# Altium schematic sheet OV7725.SchDoc
size A4
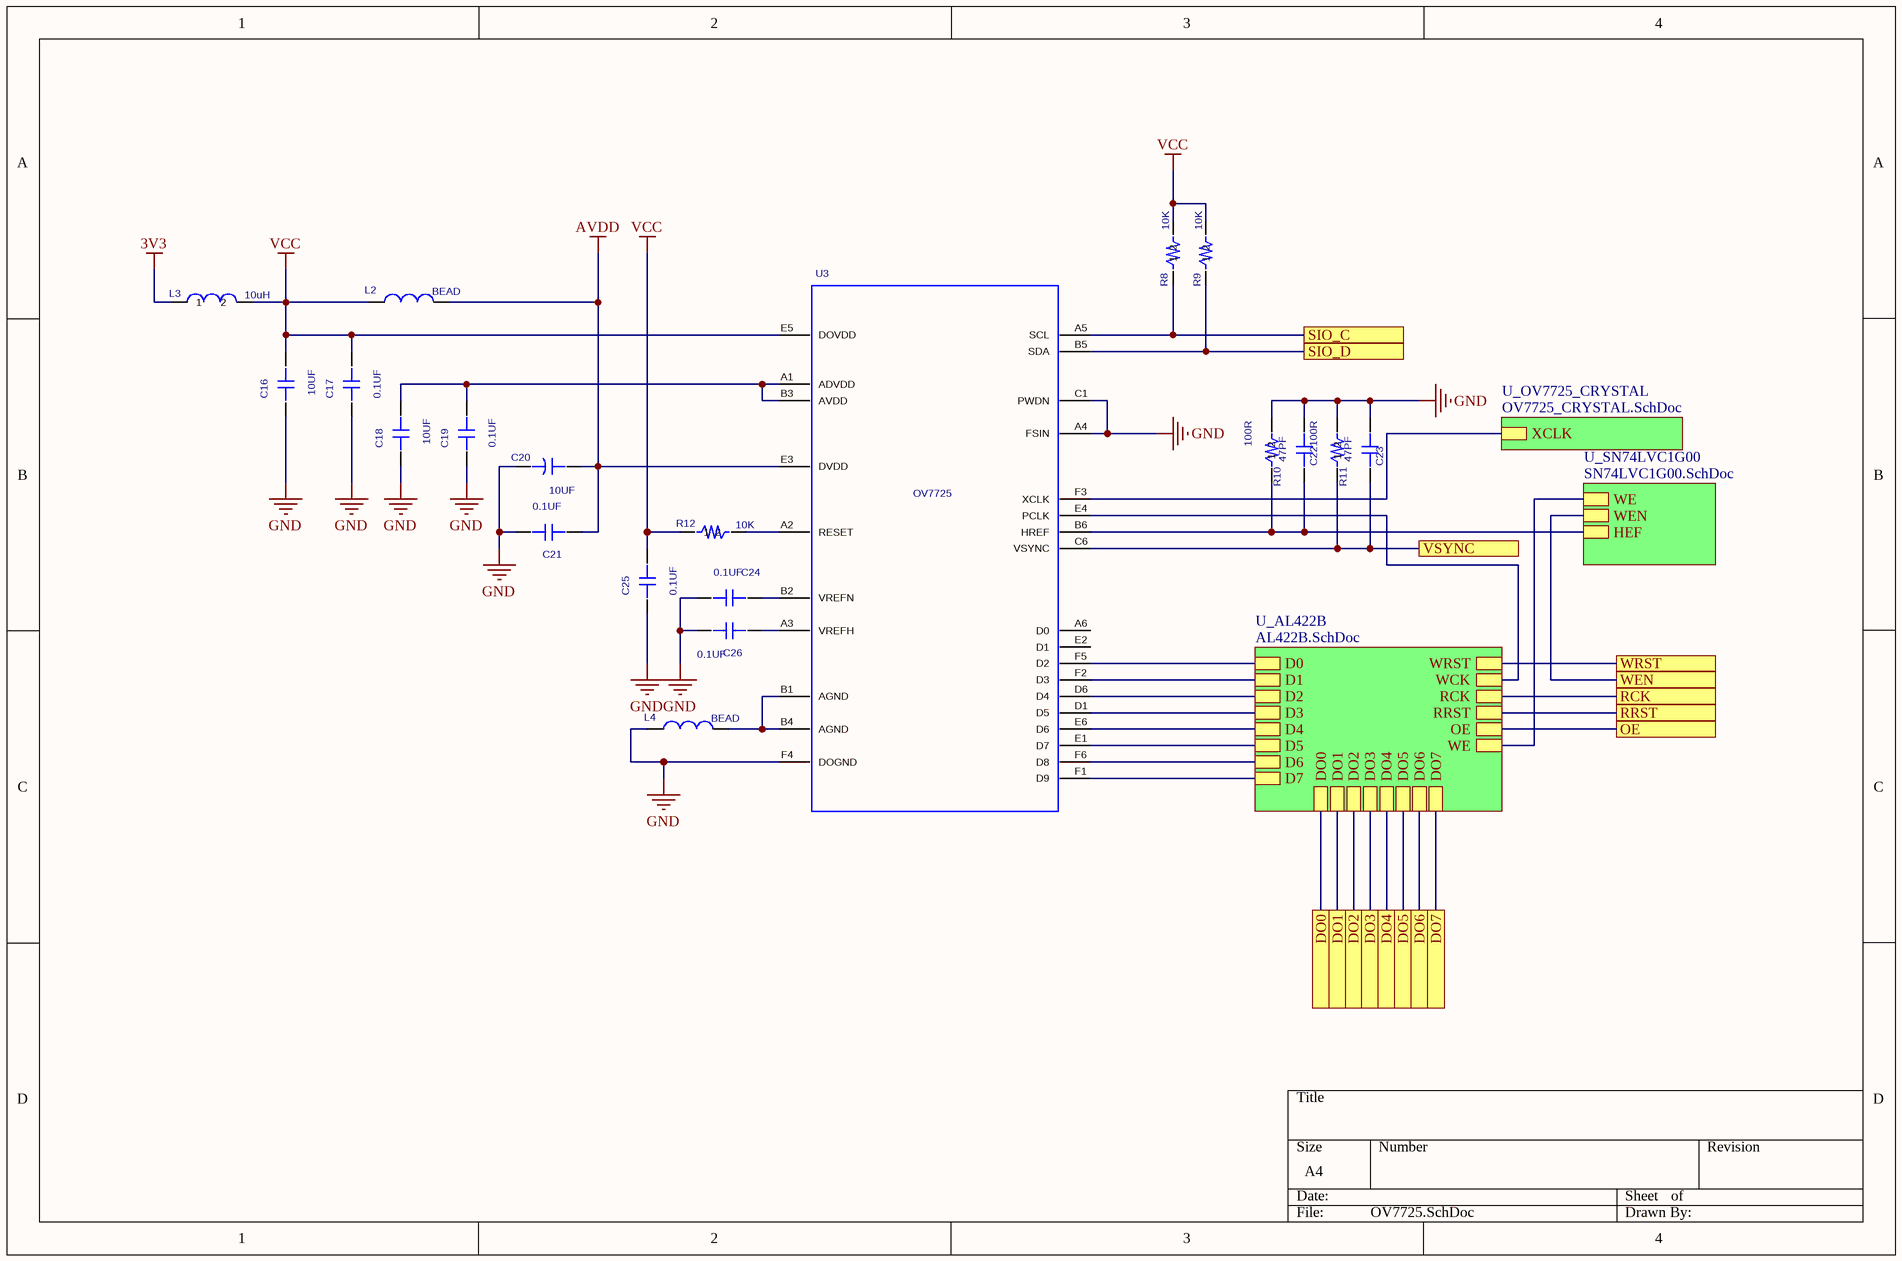
[diagram p0: OV7725.SchDoc]

## Parts
C16  value 10UF  [CAP_0603_FIRE]  (hidden comment: CAP_10UF_0603_FIRE)
C17  value 0.1UF  [SC0402]  (hidden comment: CAP_0.1UF_0402_FIRE)
C18  value 10UF  [CAP_0603_FIRE]  (hidden comment: CAP_10UF_0603_FIRE)
C19  value 0.1UF  [SC0402]  (hidden comment: CAP_0.1UF_0402_FIRE)
C20  value 10UF  [C1206]  (hidden comment: CAP+_10UF_C1206_FIRE)
C21  value 0.1UF  [SC0402]  (hidden comment: CAP_0.1UF_0402_FIRE)
C22  value 47PF  [SC0402]  (hidden comment: CAP_47PF_0402_FIRE)
C23  value 47PF  [SC0402]  (hidden comment: CAP_47PF_0402_FIRE)
C24  value 0.1UF  [SC0402]  (hidden comment: CAP_0.1UF_0402_FIRE)
C25  value 0.1UF  [SC0402]  (hidden comment: CAP_0.1UF_0402_FIRE)
C26  value 0.1UF  [SC0402]  (hidden comment: CAP_0.1UF_0402_FIRE)
L2  value BEAD  [L0603]  (hidden comment: BEAD-220/100MHZ-0603)
L3  value 10uH  [L0805]  (hidden comment: IND_10UH_0805_FIRE)
L4  value BEAD  [L0603]  (hidden comment: BEAD-220/100MHZ-0603)
R8  value 10K  [SR0402]  (hidden comment: RES_10K_0402_FIRE)
R9  value 10K  [SR0402]  (hidden comment: RES_10K_0402_FIRE)
R10  value 100R  [SR0402]  (hidden comment: RES_100R_0402_FIRE)
R11  value 100R  [SR0402]  (hidden comment: RES_100R_0402_FIRE)
R12  value 10K  [SR0402]  (hidden comment: RES_10K_0402_FIRE)
U3  value OV7725  [OV7725_CSP2_FIRE]  (hidden comment: OV7725_FIRE)

## Sub-sheets
U_AL422B = AL422B.SchDoc: D0, D1, D2, D3, D4, D5, D6, D7, WE, WRST, WCK, RCK, RRST, OE, DO0, DO7, DO1, DO2, DO3, DO4, DO5, DO6
U_OV7725_CRYSTAL = OV7725_CRYSTAL.SchDoc: XCLK
U_SN74LVC1G00 = SN74LVC1G00.SchDoc: WE, HEF, WEN

## Ports
DO0, DO1, DO2, DO3, DO4, DO5, DO6, DO7, OE, RCK, RRST, SIO_C, SIO_D, VSYNC, WEN, WRST

## Nets
3V3: L3.1
AVDD: C20.1(+) C21.1 L2.2 U3.E3(DVDD)
GND: C16.1 C17.1 C18.1 C19.1 C20.2(-) C21.2 C22.2 C23.2 C24.2 C25.1 C26.2 L4.1 R10.2 R11.2 U3.A4(FSIN) U3.C1(PWDN) U3.F4(DOGND)
VCC: C16.2 C17.2 C25.2 L2.1 L3.2 R8.2 R9.2 R12.1 U3.E5(DOVDD)
DO0: port DO0, sheet U_AL422B/DO0
DO1: port DO1, sheet U_AL422B/DO1
DO2: port DO2, sheet U_AL422B/DO2
DO3: port DO3, sheet U_AL422B/DO3
DO4: port DO4, sheet U_AL422B/DO4
DO5: port DO5, sheet U_AL422B/DO5
DO6: port DO6, sheet U_AL422B/DO6
DO7: port DO7, sheet U_AL422B/DO7
OE: port OE, sheet U_AL422B/OE
RCK: port RCK, sheet U_AL422B/RCK
RRST: port RRST, sheet U_AL422B/RRST
SIO_C: R8.1 U3.A5(SCL) ; port SIO_C
SIO_D: R9.1 U3.B5(SDA) ; port SIO_D
VSYNC: C23.1 R11.1 U3.C6(VSYNC) ; port VSYNC
WEN: port WEN, sheet U_SN74LVC1G00/WEN
WRST: port WRST, sheet U_AL422B/WRST
NetC18_2: C18.2 C19.2 U3.A1(ADVDD) U3.B3(AVDD)
NetC22_1: C22.1 R10.1 U3.B6(HREF) ; sheet U_SN74LVC1G00/HEF
NetC24_1: C24.1 U3.B2(VREFN)
NetC26_1: C26.1 U3.A3(VREFH)
NetL4_2: L4.2 U3.B1(AGND) U3.B4(AGND)
NetR12_2: R12.2 U3.A2(RESET)
NetU3_D1: U3.D1(D5) ; sheet U_AL422B/D3
NetU3_D6: U3.D6(D4) ; sheet U_AL422B/D2
NetU3_E1: U3.E1(D7) ; sheet U_AL422B/D5
NetU3_E4: U3.E4(PCLK) ; sheet U_AL422B/WCK
NetU3_E6: U3.E6(D6) ; sheet U_AL422B/D4
NetU3_F1: U3.F1(D9) ; sheet U_AL422B/D7
NetU3_F2: U3.F2(D3) ; sheet U_AL422B/D1
NetU3_F3: U3.F3(XCLK) ; sheet U_OV7725_CRYSTAL/XCLK
NetU3_F5: U3.F5(D2) ; sheet U_AL422B/D0
NetU3_F6: U3.F6(D8) ; sheet U_AL422B/D6
(unnamed): sheet U_AL422B/WE, sheet U_SN74LVC1G00/WE

Not connected (* = marked no-connect by the designer): U3 A6(D0) E2(D1)

## Library data of the parts
C16 C18 = CAP_10UF_0603_FIRE: SURFACE MOUNT CAPACITOR 0.031 X 0.061 INCHES; PCB DECAL: CAP_0603_FIRE
C17 C19 C21 C24-C26 = CAP_0.1UF_0402_FIRE: 0402; Manufacture 1 P/N: 0.1uF(0402); PCB DECAL: SC0402
C22 C23 = CAP_47PF_0402_FIRE: Manufacture 1 P/N: 47PF(0402); PCB DECAL: SC0402
L2 L4 = BEAD-220/100MHZ-0603: 0603,BEAD; Manufacturer #1 PN: BEAD; PCB DECAL: L0603
L3 = IND_10UH_0805_FIRE: 0805; Manufacture 1 P/N: 10uH; PCB DECAL: L0805
R8 R9 R12 = RES_10K_0402_FIRE: 0402; Manufacture 1: SUPEROHM; Assembly: SMD; Tolerance: +-5%; PCB DECAL: SR0402
R10 R11 = RES_100R_0402_FIRE: 100R(0402); Assembly: SMD; PCB DECAL: SR0402
U3 = OV7725_FIRE: OV7725,30w; Manufacture 1: OV; Assembly: SMD; Manufacture 1 P/N: OV7725; PCB DECAL: OV7725_CSP2_FIRE
C20 = CAP+_10UF_C1206_FIRE: Manufacture 1 P/N: 10uF; PCB DECAL: C1206